# EAGLE design Lilypad Minifade (EAGLE 6.5.0)
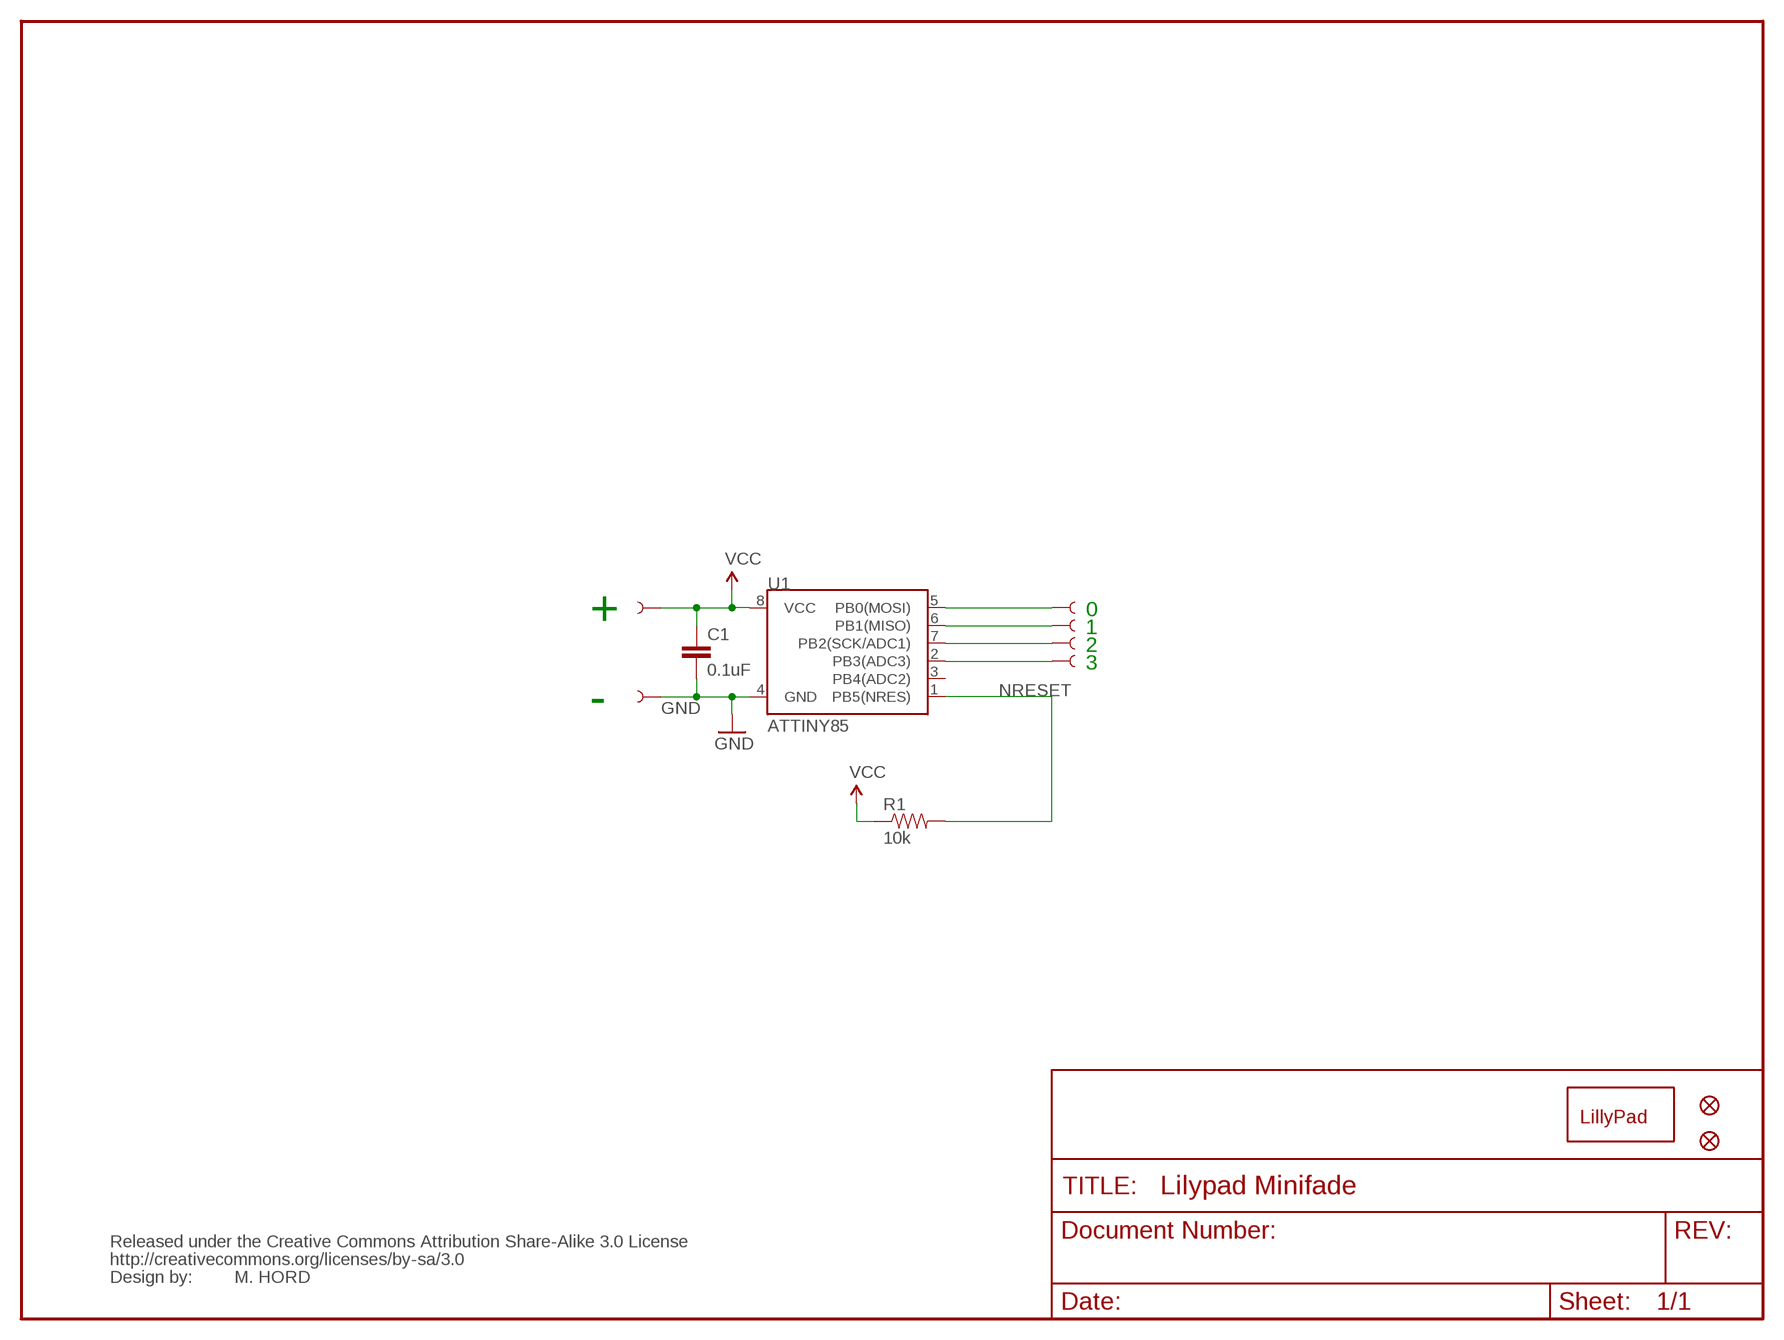
[diagram p0: schematic, sheet 1]

## Parts
C1  0.1uF  CAP0402-CAP  [0402-CAP]
JP1  FIDUCIALUFIDUCIAL  [MICRO-FIDUCIAL]
JP2  FIDUCIALUFIDUCIAL  [MICRO-FIDUCIAL]
R1  10k  RESISTOR0402-RES  [0402-RES]
U1  ATTINY85  ATTINY45  [SO08-EIAJ]
U$1  CREATIVE_COMMONS  [CREATIVE_COMMONS]
U$2  SEWTAP6  [PETAL-SMALL-2SIDE]
U$3  SEWTAP6  [PETAL-SMALL-2SIDE]
U$4  SEWTAP6  [PETAL-SMALL-2SIDE]
U$5  SEWTAP6  [PETAL-SMALL-2SIDE]
U$6  SEWTAP6  [PETAL-SMALL-2SIDE]
U$7  SEWTAP6  [PETAL-SMALL-2SIDE]
U$8  LOGO-LPL  [LOGO-L]

## Nets
GND: C1.2 U1.4(GND) U$2.1
N$3: U1.5(PB0(MOSI)) U$7.1
N$4: U1.6(PB1(MISO)) U$3.1
N$5: U1.7(PB2(SCK/ADC1)) U$4.1
N$6: U1.2(PB3(ADC3)) U$6.1
NRESET: R1.2 U1.1(PB5(NRES))
VCC: C1.1 R1.1 U1.8(VCC) U$5.1
Unconnected: U1.3(PB4(ADC2))

## Notes on the sheet
- 0
- +
- 1
- 2
- 3
- -
- M. HORD

## Library data of the parts
C1 = SparkFun:CAP: Capacitor Standard 0603 ceramic capacitor, and 0.1" leaded capacitor.
JP1 JP2 = SparkFun:FIDUCIAL: Fiducial Alignment Points Various fiducial points for machine vision alignment.
R1 = SparkFun:RESISTOR: Resistor Basic schematic elements and footprints for 0603, 1206, and PTH resistors.
U1 = SparkFun:ATTINY45: Atmel ATTiny45
U$1 = SparkFun:CREATIVE_COMMONS
U$2-U$7 = LilyPad-Wearables:SEWTAP
U$8 = LilyPad-Wearables:LOGO-LP

## Board
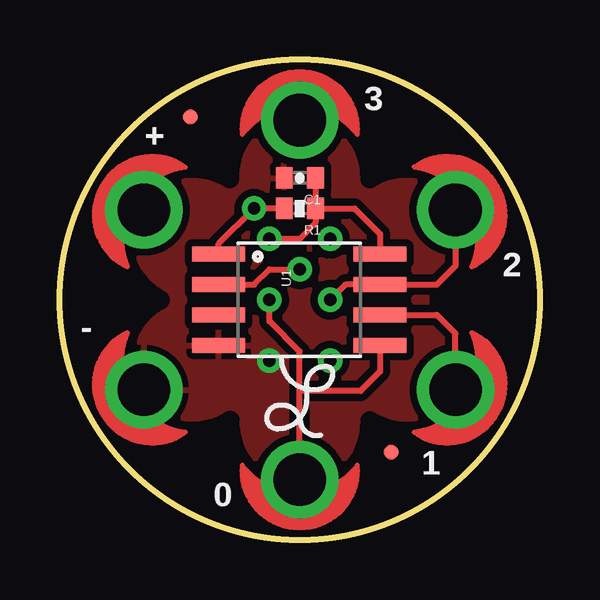
[diagram p1: board, top side]
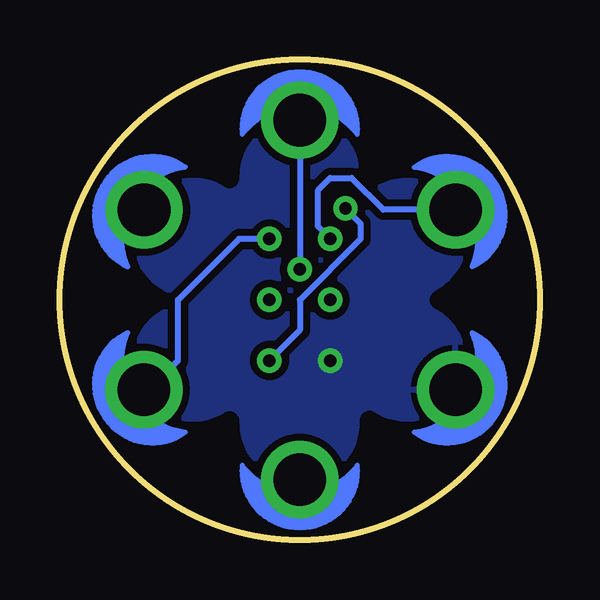
[diagram p2: board, bottom side, seen from below]

Size 20 x 20 mm. Coordinates in mm from the lower left corner, seen from the top.
Outline: circle at 10,10 radius 10
Copper layers (1*16): Top 0.035mm / dielectric 1.5mm / Bottom 0.035mm
Design rules "default": minimum track width 8mil, minimum drill 20mil, track to track 8mil, track to pad 8mil, pad to pad 8mil, via to via 8mil, smd to smd 8mil, copper to edge 8mil, drill to drill 8mil, minimum pad ring 12mil, minimum via ring 10mil, stop-mask expansion 4mil, vias tented up to drill 20mil, thermal gap 10mil
tRestrict: area -1,10 to 10,21; area 10,10 to 21,21; area 10,-1 to 21,10; area -1,-1 to 10,10; 6 lines
bRestrict: area -1,10 to 10,21; area 10,10 to 21,21; area 10,-1 to 21,10; area -1,-1 to 10,10; 6 lines

### Footprints (pad centres in the part's own frame; a part is rotated, then mirrored left to right if it is on the bottom)
0402-CAP = smd 0.7 x 0.9: 1 -0.65,0; 2 0.65,0
MICRO-FIDUCIAL = smd 0.635 x 0.635: 1 0,0
0402-RES = smd 0.7 x 0.9: 1 -0.65,0; 2 0.65,0
SO08-EIAJ = smd 0.61 x 2.21: 1 -1.905,-3.378; 2 -0.635,-3.378; 3 0.635,-3.378; 4 1.905,-3.378; 5 1.905,3.353; 6 0.635,3.353; 7 -0.635,3.353; 8 -1.905,3.353
PETAL-SMALL-2SIDE = drill 2.2: 1 0,0

### Placement (x,y rotation side)
C1  10,15.08 180 top
JP1  5.43,17.62 0 top
JP2  13.81,3.65 0 top
R1  10,13.81 180 top
U1  10,10 270 top
U$1  21.43,-14.13 0 top  (outside the outline)
U$2  3.5,6.25 300 top
U$3  16.5,6.25 60 top
U$4  16.49,13.75 120 top
U$5  3.5,13.75 240 top
U$6  10,17.49 180 top
U$7  10,2.5 0 top
U$8  10,5.94 0 top

### Tracks (layer width: path | path; a pad name or v marks a point on that pad's centre or on a via)
GND  (via drill 0.51)
  other vias: 8.73,7.46
  pour Bottom (isolate 0.305): 1.11,18.89 1.11,1.11 18.89,1.11 18.89,18.89
  pour Top (isolate 0.305): 1.11,18.89 1.11,1.11 18.89,1.11 18.89,18.89
N$3
  Top 0.254: 8.73,10 8.73,9.11 10,7.84 10,6.19 | U$7.1 10,6.19 | U1.5 13.35,7 12.54,6.19 10,6.19
N$4
  Top 0.254: U1.6 15.71,9.37 16.5,8.58 U$3.1
  Bottom 0.254: U$3.1 16.29,6.25 15.08,7.46 15.08,10
N$5
  Top 0.254: 11.27,10 11.9,10.63 U1.7 15.71,10.63 16.49,11.41 U$4.1
N$6  (via drill 0.51)
  Top 0.254: U1.2 8.1,10.63 8.73,11.27 v10,11.27
  Bottom 0.254: U$6.1 v10,11.27
N$7  (via drill 0.51)
  other vias: 8.73,10
N$8  (via drill 0.51)
  other vias: 11.27,10
N$9  (via drill 0.51)
  Bottom 0.254: v11.27,12.54 12.54,12.54 15.08,10
NRESET  (via drill 0.51)
  Top 0.254: R1.2 v8.1,13.81 6.62,12.34 U1.1
  Bottom 0.254: v8.1,13.81 7.46,13.18 7.46,12.54 10,10 10,8.73 v11.27,7.46
VCC  (via drill 0.51)
  Top 0.254: U1.8 13.35,12.74 12.29,13.81 R1.1 | C1.1 R1.1 | R1.1 10.65,13.19 10,12.54 v8.73,12.54
  Bottom 0.254: v8.73,12.54 9.24,13.05 9.24,14.57 8.73,15.08 7.84,15.08 6.51,13.75 U$5.1

### Text on the board
tPlace: 3 | + | 2 | - | 1 | 0
tValues: M. HORD